# Altium schematic sheet MAIN.SchDoc: Main
size A4; DrawnBy: Zigman Nikita; Organization: Zigman Nikita; Address3: zigman.nikita@gmail.com; DocumentNumber: 1.0; Revision: ZN; SheetNumber: 1; SheetTotal: 6
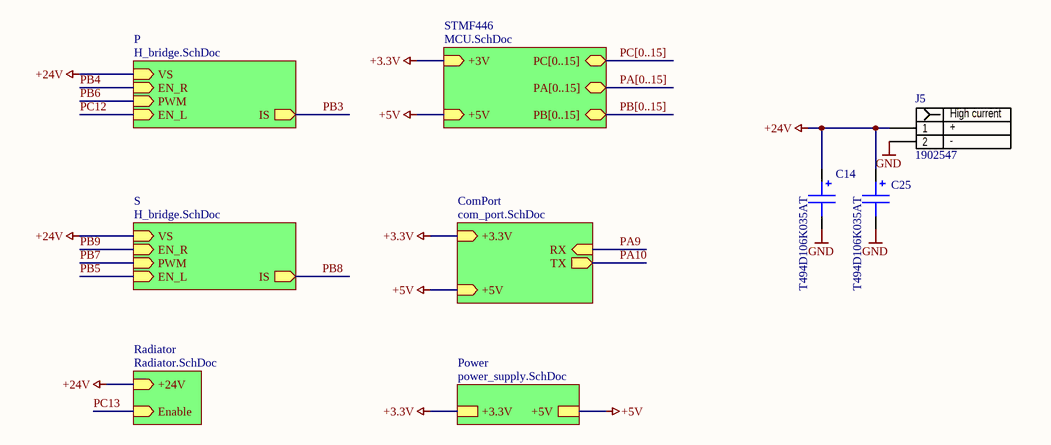
[diagram p0: MAIN.SchDoc]

## Parts
C14  T494D106K035AT  [CAPPM7343X310N]
C25  T494D106K035AT  [CAPPM7343X310N]
J5  1902547  [1902547]

## Sub-sheets
P = H_bridge.SchDoc: EN_R (in), IS (out), PWM (in), EN_L (in), VS (in)
Power = power_supply.SchDoc: +5V, +3.3V
Radiator = Radiator.SchDoc: Enable (in), +24V (in)
S = H_bridge.SchDoc: EN_R (in), PWM (in), EN_L (in), VS (in), IS (out)
STMF446 = MCU.SchDoc: PC[0..15] (bidir), PA[0..15] (bidir), +3V (in), PB[0..15] (bidir), +5V (in)
СomPort = com_port.SchDoc: RX (in), +3.3V (in), TX (out), +5V (in)

## Nets
+3.3V: sheet STMF446/+3V, sheet СomPort/+3.3V, sheet Power/+3.3V
+5V: sheet STMF446/+5V, sheet СomPort/+5V, sheet Power/+5V
+24V: C14.1(+) C25.1(+) J5.1 ; sheet P/VS, sheet S/VS, sheet Radiator/+24V
GND: C14.2(-) C25.2(-) J5.2
PA9: sheet СomPort/RX
PA10: sheet СomPort/TX
PB3: sheet P/IS
PB4: sheet P/EN_R
PB5: sheet S/EN_L
PB6: sheet P/PWM
PB7: sheet S/PWM
PB8: sheet S/IS
PB9: sheet S/EN_R
PC12: sheet P/EN_L
PC13: sheet Radiator/Enable

## Buses and harness runs
bus PA[0..15] = sheet STMF446/PA[0..15]
bus PB[0..15] = sheet STMF446/PB[0..15]
bus PC[0..15] = sheet STMF446/PC[0..15]

## Notes on the sheet
- Title
- Size:
- Date:
- A4
- Number:
- Time:
- Revision:
- Sheet
- of
- File:
- (in symbol 1902547) High current; +; -

## Library data of the parts
C14 C25 = T494D106K035AT: Capacitor Polarised; Manufacturer_Name: Kemet; Datasheet Link: http://www.mouser.com/ds/2/212/kemet_kem_t2008_t494-544880.pdf; Height: 3.1mm; Manufacturer_Part_Number: T494D106K035AT; Arrow Part Number: T494D106K035AT; Arrow Price/Stock: https://www.arrow.com/en/products/t494d106k035at/kemet-corporation; Mouser Part Number: 80-T494D106K035; Mouser Price/Stock: https://www.mouser.com/Search/Refine.aspx?Keyword=80-T494D106K035
J5 = 1902547: Connector; Manufacturer_Name: Phoenix Contact; Datasheet Link: https://www.arrow.com/en/products/1902547/phoenix-contact; Height: 21.7mm; Manufacturer_Part_Number: 1902547; Arrow Part Number: 1902547; Arrow Price/Stock: https://www.arrow.com/en/products/1902547/phoenix-contact; Mouser Part Number: 651-1902547; Mouser Price/Stock: https://www.mouser.co.uk/ProductDetail/Phoenix-Contact/1902547?qs=wd%252Bw3mUqFrmbAnEXicRpKg%3D%3D